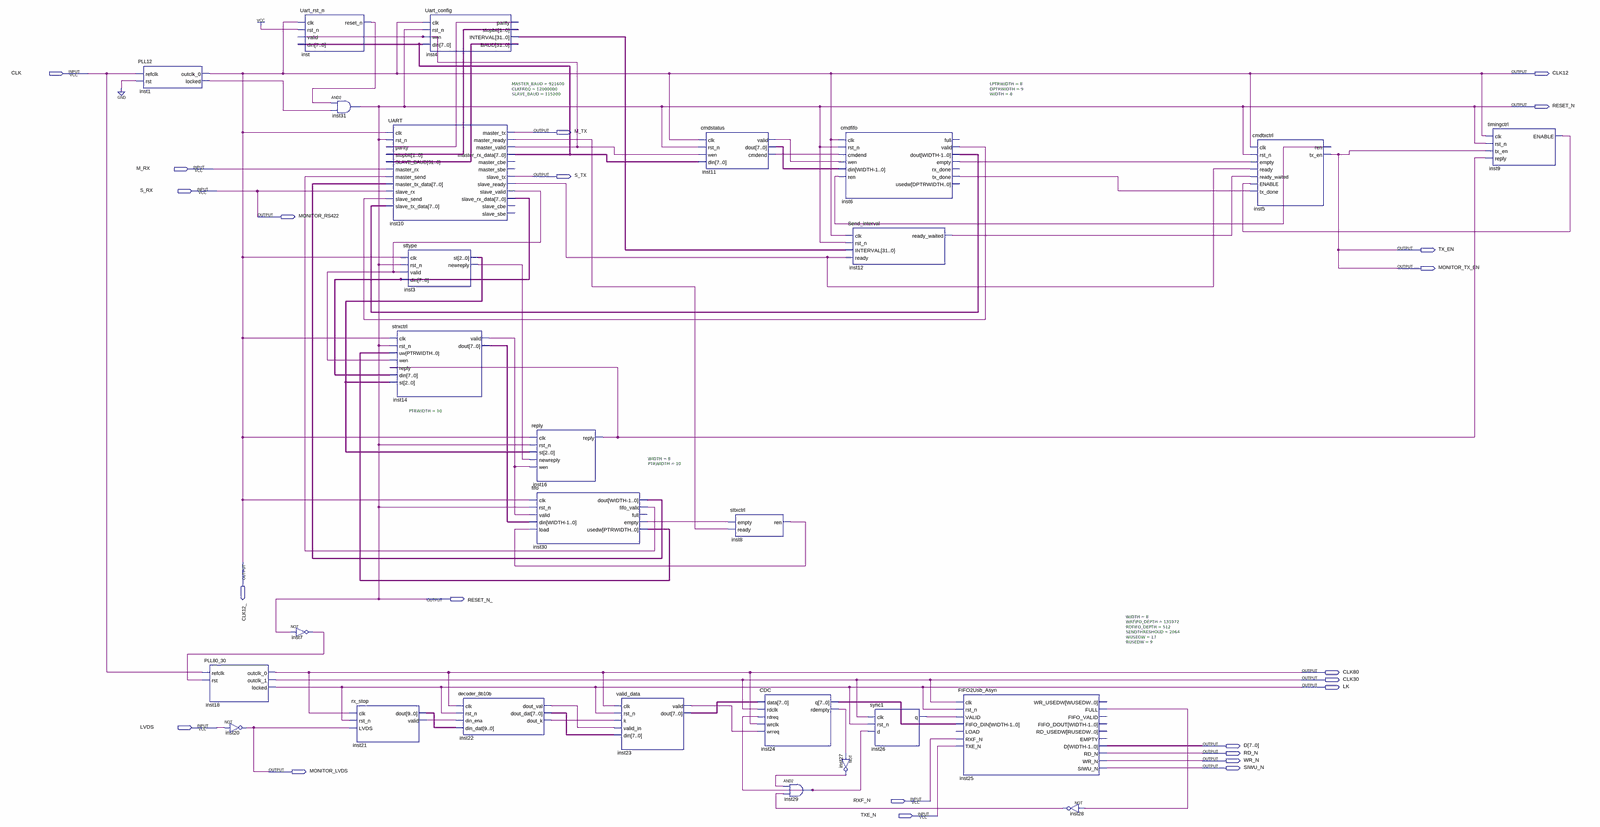
[diagram p0: schematic sheet, whole]
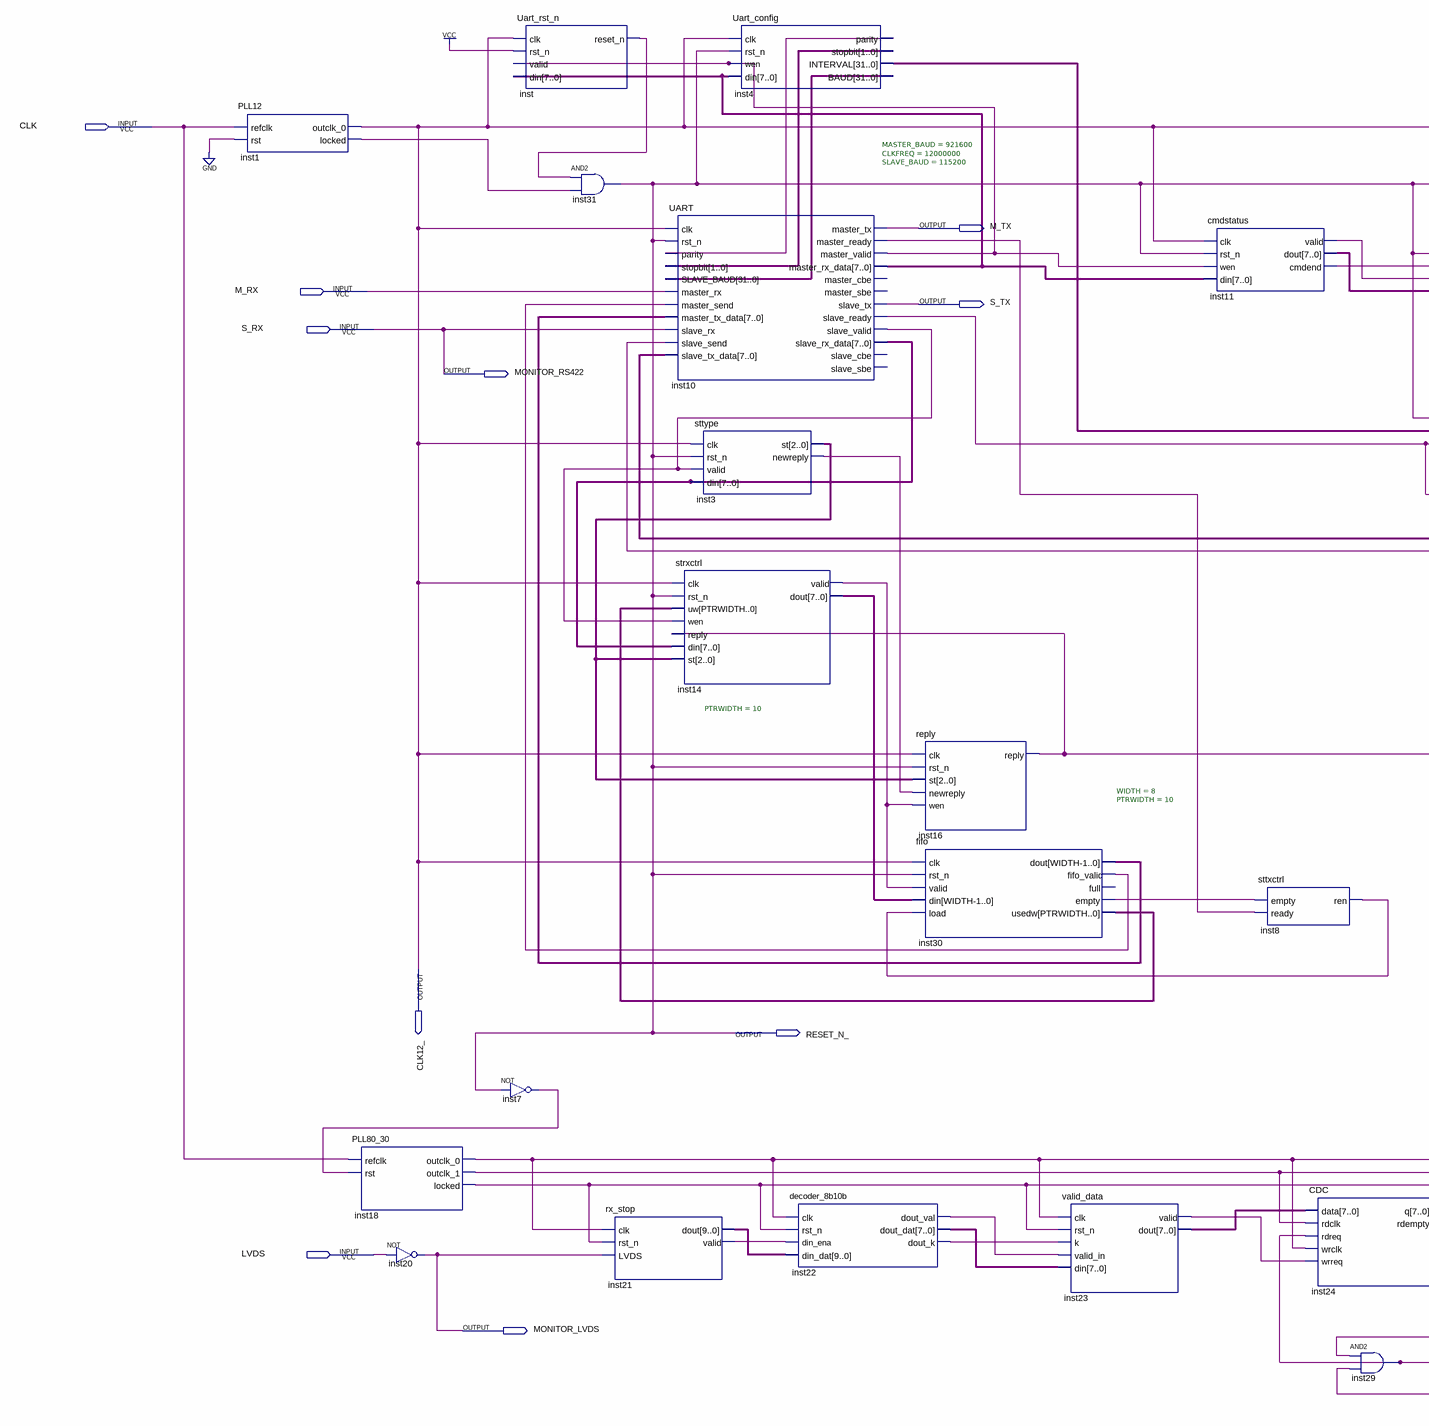
[diagram p1: schematic sheet, left part]
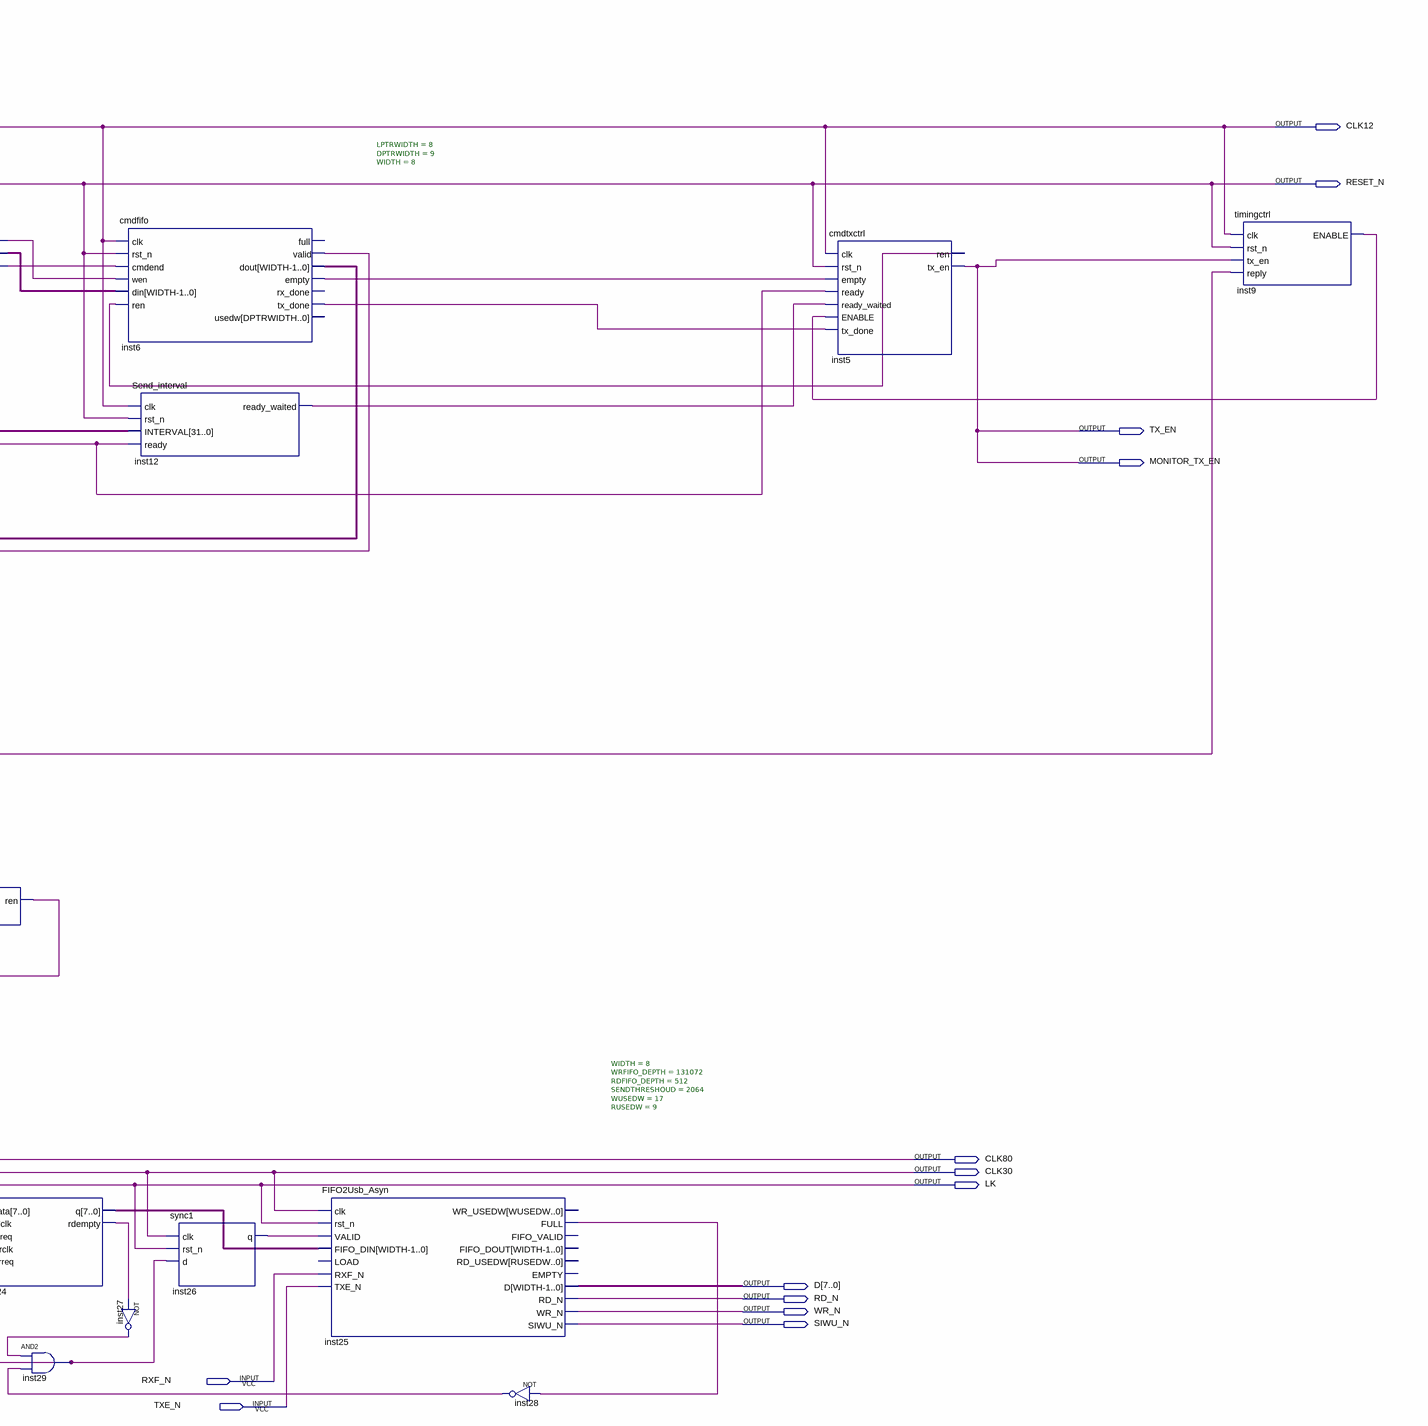
[diagram p2: schematic sheet, right part]
// Quartus schematic CMDSCI.bdf as structural Verilog: 27 symbols, 23 pins
module CMDSCI (
  input  CLK,
  input  M_RX,
  input  S_RX,
  input  LVDS,
  input  RXF_N,
  input  TXE_N,
  output CLK12,
  output RESET_N,
  output M_TX,
  output S_TX,
  output MONITOR_RS422,
  output TX_EN,
  output MONITOR_TX_EN,
  output CLK12_,
  output RESET_N_,
  output CLK80,
  output CLK30,
  output LK,
  output [7:0] D,
  output RD_N,
  output WR_N,
  output SIWU_N,
  output MONITOR_LVDS
);

  wire inst1_locked, inst3_newreply, inst4_parity, inst5_ren, inst6_empty, inst6_tx_done, inst6_valid,
       inst7_out, inst8_ren, inst9_enable, inst10_master_ready, inst10_master_valid, inst10_slave_ready,
       inst10_slave_valid, inst11_cmdend, inst11_valid, inst12_ready_waited, inst14_valid, inst16_reply,
       inst21_valid, inst22_dout_k, inst22_dout_val, inst23_valid, inst24_rdempty, inst25_full, inst26_q,
       inst27_out, inst28_out, inst29_out, inst30_empty, inst30_fifo_valid, inst_reset_n;
  wire [1:0] inst4_stopbit;
  wire [2:0] inst3_st;
  wire [7:0] inst6_dout, inst10_master_rx_data, inst10_slave_rx_data, inst11_dout, inst14_dout,
       inst22_dout_dat, inst23_dout, inst24_q, inst30_dout;
  wire [9:0] inst21_dout;
  wire [10:0] inst30_usedw;
  wire [31:0] inst4_baud, inst4_interval;

  PLL12 inst1 (.refclk(CLK), .rst(1'b0), .outclk_0(CLK12), .locked(inst1_locked));
  PLL80_30 inst18 (.refclk(CLK), .rst(inst7_out), .outclk_0(CLK80), .outclk_1(CLK30), .locked(LK));
  not inst20 (MONITOR_LVDS, LVDS);
  Uart_rst_n inst (
    .clk(CLK12), .rst_n(1'b1), .valid(inst10_master_valid), .din(inst10_master_rx_data),
    .reset_n(inst_reset_n));
  not inst7 (inst7_out, RESET_N);
  and inst31 (RESET_N, inst_reset_n, inst1_locked);
  rx_stop inst21 (.clk(CLK80), .rst_n(LK), .LVDS(MONITOR_LVDS), .dout(inst21_dout), .valid(inst21_valid));
  UART #(.MASTER_BAUD(921600), .CLKFREQ(12000000), .SLAVE_BAUD(115200)) inst10 (
    .clk(CLK12), .rst_n(RESET_N), .parity(inst4_parity), .stopbit(inst4_stopbit), .SLAVE_BAUD(inst4_baud),
    .master_rx(M_RX), .master_send(inst30_fifo_valid), .master_tx_data(inst30_dout), .slave_rx(S_RX),
    .slave_send(inst6_valid), .slave_tx_data(inst6_dout), .master_tx(M_TX),
    .master_ready(inst10_master_ready), .master_valid(inst10_master_valid),
    .master_rx_data(inst10_master_rx_data), .slave_tx(S_TX), .slave_ready(inst10_slave_ready),
    .slave_valid(inst10_slave_valid), .slave_rx_data(inst10_slave_rx_data));  // open: master_cbe, master_sbe, slave_cbe, slave_sbe
  sttype inst3 (
    .clk(CLK12), .rst_n(RESET_N), .valid(inst10_slave_valid), .din(inst10_slave_rx_data), .st(inst3_st),
    .newreply(inst3_newreply));
  strxctrl #(.PTRWIDTH(10)) inst14 (
    .clk(CLK12), .rst_n(RESET_N), .uw(inst30_usedw), .wen(inst10_slave_valid), .reply(inst16_reply),
    .din(inst10_slave_rx_data), .st(inst3_st), .valid(inst14_valid), .dout(inst14_dout));
  Uart_config inst4 (
    .clk(CLK12), .rst_n(RESET_N), .wen(inst10_master_valid), .din(inst10_master_rx_data),
    .parity(inst4_parity), .stopbit(inst4_stopbit), .INTERVAL(inst4_interval), .BAUD(inst4_baud));
  decoder_8b10b inst22 (
    .clk(CLK80), .rst_n(LK), .din_ena(inst21_valid), .din_dat(inst21_dout), .dout_val(inst22_dout_val),
    .dout_dat(inst22_dout_dat), .dout_k(inst22_dout_k));
  reply inst16 (
    .clk(CLK12), .rst_n(RESET_N), .st(inst3_st), .newreply(inst3_newreply), .wen(inst14_valid),
    .reply(inst16_reply));
  fifo #(.WIDTH(8), .PTRWIDTH(10)) inst30 (
    .clk(CLK12), .rst_n(RESET_N), .valid(inst14_valid), .din(inst14_dout), .load(inst8_ren),
    .dout(inst30_dout), .fifo_valid(inst30_fifo_valid), .empty(inst30_empty), .usedw(inst30_usedw));  // open: full
  valid_data inst23 (
    .clk(CLK80), .rst_n(LK), .k(inst22_dout_k), .valid_in(inst22_dout_val), .din(inst22_dout_dat),
    .valid(inst23_valid), .dout(inst23_dout));
  cmdstatus inst11 (
    .clk(CLK12), .rst_n(RESET_N), .wen(inst10_master_valid), .din(inst10_master_rx_data),
    .valid(inst11_valid), .dout(inst11_dout), .cmdend(inst11_cmdend));
  sttxctrl inst8 (.empty(inst30_empty), .ready(inst10_master_ready), .ren(inst8_ren));
  CDC inst24 (
    .data(inst23_dout), .rdclk(CLK30), .rdreq(inst29_out), .wrclk(CLK80), .wrreq(inst23_valid), .q(inst24_q),
    .rdempty(inst24_rdempty));
  and inst29 (inst29_out, inst27_out, inst28_out);
  cmdfifo #(.LPTRWIDTH(8), .DPTRWIDTH(9), .WIDTH(8)) inst6 (
    .clk(CLK12), .rst_n(RESET_N), .cmdend(inst11_cmdend), .wen(inst11_valid), .din(inst11_dout),
    .ren(inst5_ren), .valid(inst6_valid), .dout(inst6_dout), .empty(inst6_empty), .tx_done(inst6_tx_done));  // open: full, rx_done, usedw
  Send_interval inst12 (
    .clk(CLK12), .rst_n(RESET_N), .INTERVAL(inst4_interval), .ready(inst10_slave_ready),
    .ready_waited(inst12_ready_waited));
  not inst27 (inst27_out, inst24_rdempty);
  sync1 inst26 (.clk(CLK30), .rst_n(LK), .d(inst29_out), .q(inst26_q));
  FIFO2Usb_Asyn #(.WIDTH(8), .WRFIFO_DEPTH(131072), .RDFIFO_DEPTH(512), .SENDTHRESHOUD(2064), .WUSEDW(17), .RUSEDW(9)) inst25 (
    .clk(CLK30), .rst_n(LK), .VALID(inst26_q), .FIFO_DIN(inst24_q), .RXF_N(RXF_N), .TXE_N(TXE_N),
    .FULL(inst25_full), .RD_N(RD_N), .WR_N(WR_N), .SIWU_N(SIWU_N), .D(D));  // open: LOAD, WR_USEDW, FIFO_VALID, FIFO_DOUT, RD_USEDW, EMPTY
  not inst28 (inst28_out, inst25_full);
  cmdtxctrl inst5 (
    .clk(CLK12), .rst_n(RESET_N), .empty(inst6_empty), .ready(inst10_slave_ready),
    .ready_waited(inst12_ready_waited), .ENABLE(inst9_enable), .tx_done(inst6_tx_done), .ren(inst5_ren),
    .tx_en(MONITOR_TX_EN));
  timingctrl inst9 (.clk(CLK12), .rst_n(RESET_N), .tx_en(MONITOR_TX_EN), .reply(inst16_reply), .ENABLE(inst9_enable));

  assign CLK12_ = CLK12;
  assign MONITOR_RS422 = S_RX;
  assign RESET_N_ = RESET_N;
  assign TX_EN = MONITOR_TX_EN;
endmodule
